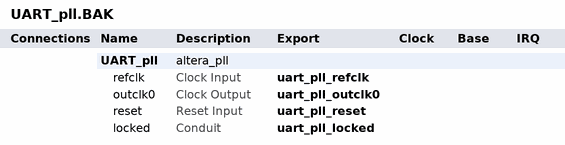
[diagram p0: system contents]
# Platform Designer (Qsys) system UART_pll.BAK, Cyclone V 5CGXFC5C6F27C7
# Parameters at their usual value, and those the tool derives, are not listed.
package require -exact qsys 16.1
create_system UART_pll.BAK
set_project_property DEVICE_FAMILY {Cyclone V}
set_project_property DEVICE 5CGXFC5C6F27C7

add_instance UART_pll altera_pll 16.1
set_instance_parameter_value UART_pll gui_device_speed_grade 2
set_instance_parameter_value UART_pll gui_number_of_clocks 1
set_instance_parameter_value UART_pll gui_operation_mode direct
set_instance_parameter_value UART_pll gui_output_clock_frequency0 1.0
set_instance_parameter_value UART_pll gui_pll_mode {Fractional-N PLL}
set_instance_parameter_value UART_pll gui_reference_clock_frequency 50.0
set_instance_parameter_value UART_pll gui_use_locked true

# exported interfaces
add_interface uart_pll_locked conduit end
set_interface_property uart_pll_locked EXPORT_OF UART_pll.locked
add_interface uart_pll_outclk0 clock source
set_interface_property uart_pll_outclk0 EXPORT_OF UART_pll.outclk0
add_interface uart_pll_refclk clock sink
set_interface_property uart_pll_refclk EXPORT_OF UART_pll.refclk
add_interface uart_pll_reset reset sink
set_interface_property uart_pll_reset EXPORT_OF UART_pll.reset

set_interconnect_requirement {$system} qsys_mm.clockCrossingAdapter HANDSHAKE
set_interconnect_requirement {$system} qsys_mm.enableEccProtection FALSE
set_interconnect_requirement {$system} qsys_mm.insertDefaultSlave FALSE
set_interconnect_requirement {$system} qsys_mm.maxAdditionalLatency 1

save_system UART_pll.BAK.qsys
